# EAGLE design lantern (EAGLE 6.5.0)
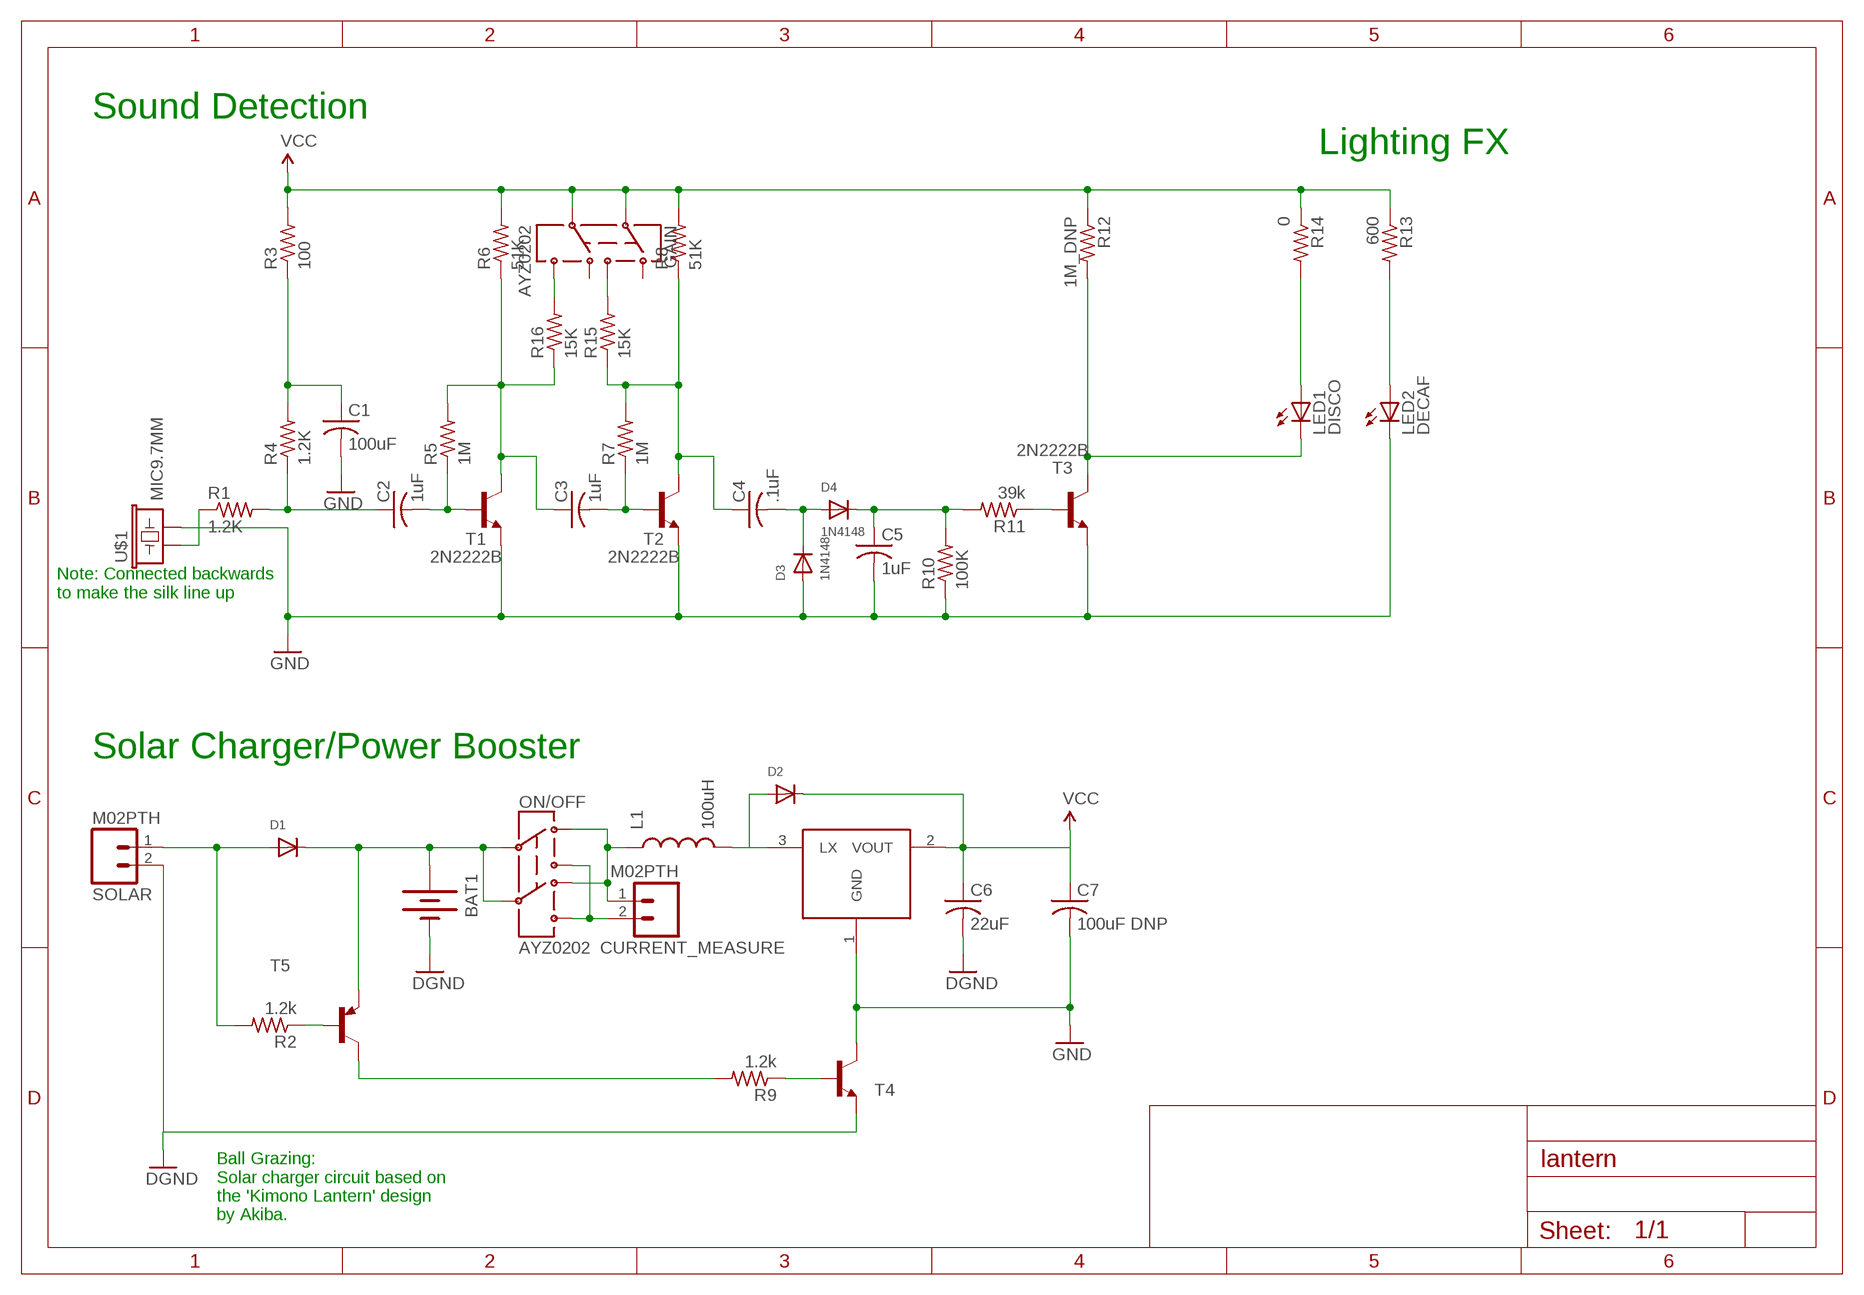
[diagram p0: schematic, sheet 1]

## Parts
BAT1  BATTERYAAA  [BATTERY-AAA]
C1  100uF  C-USC1210  [C1210]
C2  1uF  C-USC0603  [C0603]
C3  1uF  C-USC0603  [C0603]
C4  .1uF  C-USC0603  [C0603]
C5  1uF  C-USC0603  [C0603]
C6  22uF  C-USC0603  [C0603]
C7  100uF DNP  C-USC1210  [C1210]
CURRENT_MEASURE  M02PTH  [1X02]
D1  DIODESOT23_REFLOW  [SOT23-R]
D2  DIODESOT23_REFLOW  [SOT23-R]
D3  1N4148  DIODESOT23_REFLOW  [SOT23-R]
D4  1N4148  DIODESOT23_REFLOW  [SOT23-R]
GAIN  AYZ0202  [AYZ0202]
L1  100uH  INDUCTOR0805  [0805]
LED1  DISCO  LED5MM  [LED5MM]
LED2  DECAF  LED5MM  [LED5MM]
ON/OFF  AYZ0202  [AYZ0202]
R1  1.2K  R-US_R0603  [R0603]
R2  1.2k  R-US_R0603  [R0603]
R3  100  R-US_R0603  [R0603]
R4  1.2K  R-US_R0603  [R0603]
R5  1M  R-US_R0603  [R0603]
R6  51K  R-US_R0603  [R0603]
R7  1M  R-US_R0603  [R0603]
R8  51K  R-US_R0603  [R0603]
R9  1.2k  R-US_R0603  [R0603]
R10  100K  R-US_R0603  [R0603]
R11  39k  R-US_R0603  [R0603]
R12  1M_DNP  R-US_R0603  [R0603]
R13  600  R-US_R0603  [R0603]
R14  0  R-US_R0603  [R0603]
R15  15K  R-US_R0603  [R0603]
R16  15K  R-US_R0603  [R0603]
SOLAR  M02PTH  [1X02]
T1  2N2222B  [SOT23]
T2  2N2222B  [SOT23]
T3  2N2222B  [SOT23]
T4  2N2222B  [SOT23]
T5  2N2907B  [SOT23]
U2  HT7733A  [SOT89]
U$1  MIC9.7MM  [MIC-9.7MM]

## Nets
DGND: BAT1.GND@1(-) C6.2 SOLAR.2 T4.2(E)
GND: C1.2 C5.2 C7.2 D3.1(A) LED2.K(C) R10.1 T1.2(E) T2.2(E) T3.2(E) T4.3(C) U2.1(GND) U$1.2
N$1: C2.1 R1.2 R4.1
N$2: C1.1 R3.1 R4.2
N$3: C2.2 R5.1 T1.1(B)
N$4: C3.1 R5.2 R6.1 R16.1 T1.3(C)
N$5: C4.1 R7.2 R8.1 R15.1 T2.3(C)
N$6: C3.2 R7.1 T2.1(B)
N$7: R1.1 U$1.1
N$8: LED1.K(C) R12.2 T3.3(C)
N$9: R11.1 T3.1(B)
N$10: C4.2 D3.3(C) D4.1(A)
N$11: D1.1(A) R2.2 SOLAR.1
N$12: C5.1 D4.3(C) R10.2 R11.2
N$13: R9.2 T5.3(C)
N$14: R9.1 T4.1(B)
N$15: BAT1.PWR@1(+) D1.3(C) ON/OFF.2 ON/OFF.5 T5.2(E)
N$16: R2.1 T5.1(B)
N$17: CURRENT_MEASURE.1 L1.1 ON/OFF.3 ON/OFF.6
N$18: D2.1(A) L1.2 U2.3(LX)
N$19: LED2.A R13.2
N$20: LED1.A R14.2
N$21: CURRENT_MEASURE.2 ON/OFF.1 ON/OFF.4
N$22: GAIN.4 R16.2
N$23: GAIN.1 R15.2
VCC: C6.1 C7.1 D2.3(C) GAIN.2 GAIN.5 R3.2 R6.2 R8.2 R12.1 R13.1 R14.1 U2.2(VOUT)
Unconnected: GAIN.3 GAIN.6

## Notes on the sheet
- Sound Detection
- Lighting FX
- Note: Connected backwards
  to make the silk line up
- Solar Charger/Power Booster
- Ball Grazing:
  Solar charger circuit based on
  the 'Kimono Lantern' design
  by Akiba.

## Library data of the parts
BAT1 = SparkFun-Electromechanical:BATTERY: Battery Holders Various common sizes : AA, AAA, 20mm coin cell and 12mm coin cell. 20MM_4LEGS, BATT-10373
C1-C7 = adafruit:C-US: CAPACITOR, American symbol
CURRENT_MEASURE SOLAR = SparkFun-Connectors:M02: Standard 2-pin 0.1" header. Use with - straight break away headers ( PRT-00116) - right angle break away headers (PRT-00553) - swiss pins (PRT-00743) - machine pins (PRT-00117) - female headers (PRT-00115) Molex polarized connector foot print use with: PRT-08233 with associated crimp pins and housings. 2.54_SCREWTERM for use with PRT-10571. 3.5mm Screw Terminal footprints for PRT-08084 5mm Screw Terminal footprints for use with PRT-08433
D1-D4 = adafruit:DIODE: Diode SMADIODE - SMA Surface Mount Package 20V 1A Schottky Diode Digikey: 641-1014-6-ND DO-1N4148 - Through Hole Small Current Diode SOD-123 20V 1 A (.5mV Vf) Schottky Diode - Digikey: MBRX120TPMSCT-ND SOD-323 10V 570mA (.38mV Vf, 3ns) Schottky Diode - Digikey: ZLLS410CT-ND SOD-523 30V 30mA Schottky Diode (RB751S-40TE61) - Digikey: RB751S-40TE61CT-ND SOT23-R/W - SOT23 Package (R = Solder Paste/Reflow Ovens, W = Hand-Soldering) BAT54Film 40V 300mA - Digikey: 497-7162-1-ND
GAIN ON/OFF = SparkFun-Electromechanical:AYZ0202: SPDT Slide Switch Simple SMD single-pull double-throw slide switch. Good for less than 350mA power switch, switching UARTs between devices, etc. Spark Fun Electronics SKU : COM-00597
L1 = SparkFun-Passives:INDUCTOR: Inductors Basic Inductor/Choke - 0603 and 1206. Footprints are not proven and vary greatly between part numbers. SRN6045- 33uH, 20% 1.4A
LED1 LED2 = adafruit:LED: LED OSRAM: - CHIPLED LG R971, LG N971, LY N971, LG Q971, LY Q971, LO R971, LY R971 LH N974, LH R974 LS Q976, LO Q976, LY Q976 LO Q996 - Hyper CHIPLED LW Q18S LB Q993, LB Q99A, LB R99A - SideLED LS A670, LO A670, LY A670, LG A670, LP A670 LB A673, LV A673, LT A673, LW A673 LH A674 LY A675 LS A676, LA A676, LO A676, LY A676, LW A676 LS A679, LY A679, LG A679 - Hyper Micro SIDELED® LS Y876, LA Y876, LO Y876, LY Y876 LT Y87S - SmartLED LW L88C, LW L88S LB L89C, LB L89S, LG L890 LS L89K, LO L89K, LY L89K LS L896, LA L896, LO L896, LY L896 - TOPLED LS T670, LO T670, LY T670, LG T670, LP T670 LSG T670, LSP T670, LSY T670, LOP T670, LYG T670 LG T671, LOG T671, LSG T671 LB T673, LV T673, LT T673, LW T673 LH T674 LS T676, LA T676, LO T676, LY T676, LB T676, LH T676, LSB T676, LW T676 LB T67C, LV T67C, LT T67C, LS T67K, LO T67K, LY T67K, LW E67C LS E67B, LA E67B, LO E67B, LY E67B, LB E67C, LV E67C, LT E67C LW T67C LS T679, LY T679, LG T679 LS T770, LO T770, LY T770, LG T770, LP T770 LB T773, LV T773, LT T773, LW T773 LH T774 LS E675, LA E675, LY E675, LS T675 LS T776, LA T776, LO T776, LY T776, LB T776 LHGB T686 LT T68C, LB T68C - Hyper Mini TOPLED® LB M676 - Mini TOPLED Santana® LG M470 LS M47K, LO M47K, LY M47K Source: http://www.osram.convergy.de/
R1-R16 = adafruit:R-US_: RESISTOR, American symbol
T1-T4 = blinkinlabs:2N2222: NPN TRANSISTOR Big oval pads
T5 = blinkinlabs:2N2907*: PNP Transistor Big Oval pads
U2 = blinkinlabs:HT7733A
U$1 = SparkFun-Sensors:MIC: Omni-directional electret microphone. 9.7mm standard diameter.

## Board
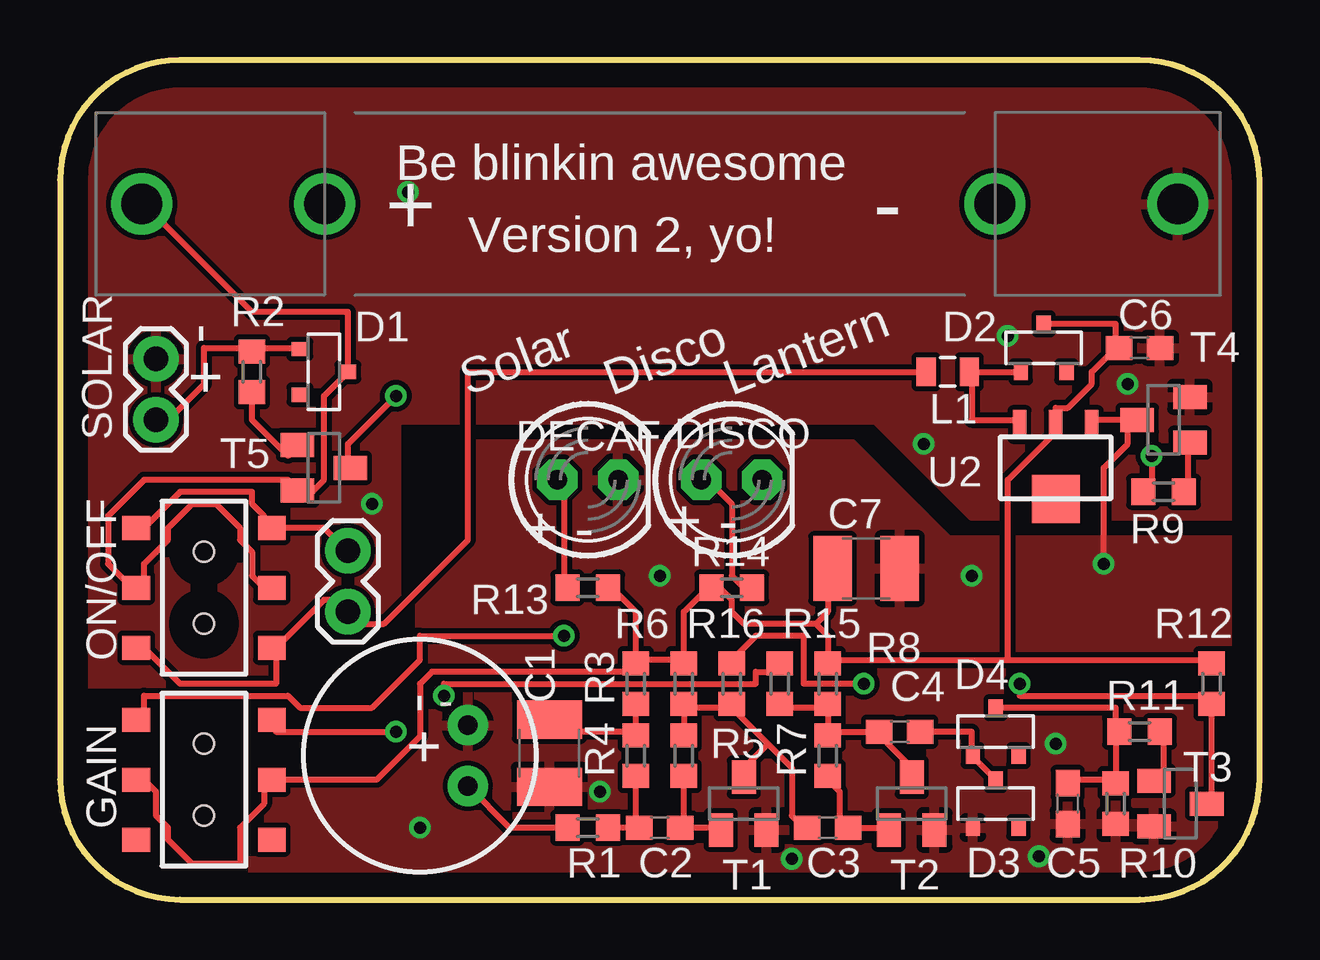
[diagram p1: board, top side]
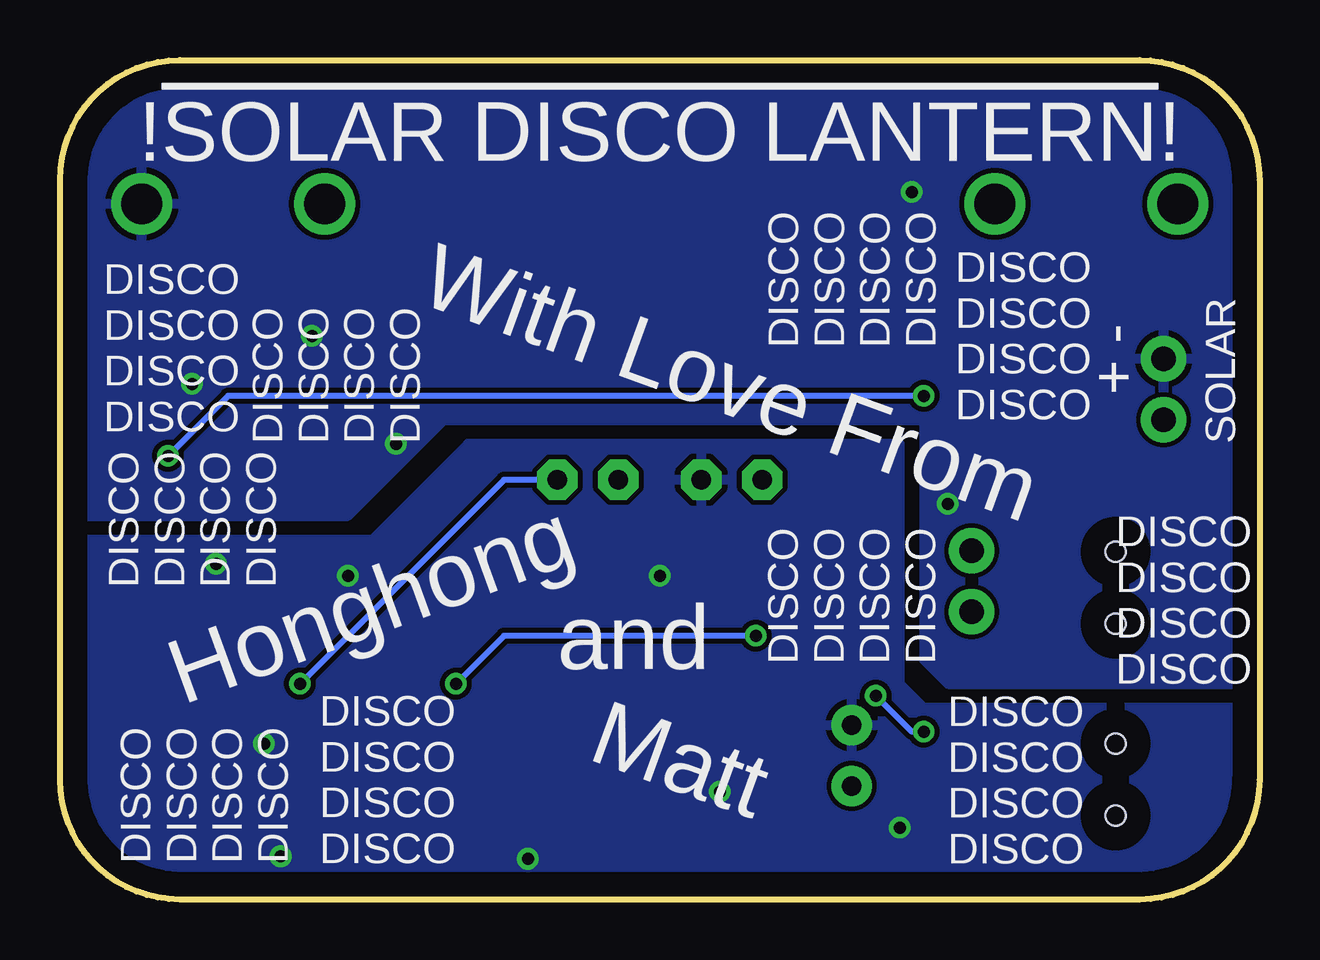
[diagram p2: board, bottom side, seen from below]

Size 50 x 35 mm. Coordinates in mm from the lower left corner, seen from the top.
Outline: 0,30 0,5 arc90 5,0 45,0 arc90 50,5 50,30 arc90 45,35 5,35 arc90 0,30
Copper layers (1*16): Top 0.035mm / dielectric 1.5mm / Bottom 0.035mm
Design rules "default *": minimum track width 10mil, minimum drill 0.3mm, track to track 8mil, track to pad 8mil, pad to pad 8mil, via to via 8mil, smd to smd 8mil, copper to edge 40mil, drill to drill 8mil, minimum pad ring 10mil, minimum via ring 8mil, stop-mask expansion 4mil, vias tented up to drill 0.5mm, thermal gap 10mil

### Footprints (pad centres in the part's own frame; a part is rotated, then mirrored left to right if it is on the bottom)
BATTERY-AAA = drill 1.702: GND@1 21.59,0; GND@2 13.97,0; PWR@1 -21.59,0; PWR@2 -13.97,0
C1210 = smd 1.6 x 2.7: 1 -1.4,0; 2 1.4,0
C0603 = smd 1.1 x 1: 1 -0.85,0; 2 0.85,0
1X02 = drill 1.016 pad 1.88: 1 0,0; 2 2.54,0
SOT23-R = smd 0.6 x 0.7: 1 -0.95,-1; 2 0.95,-1; 3 0,1
AYZ0202 = smd 1 x 1.15: 1 -2.5,2.825; 2 0,2.825; 3 2.5,2.825; 4 -2.5,-2.825; 5 0,-2.825; 6 2.5,-2.825 | hole 0.85: 1.5,0; -1.5,0
0805 = smd 0.8 x 1.2: 1 -0.9,0; 2 0.9,0
LED5MM = drill 0.813 pad 1.676 octagon: A -1.27,0; K 1.27,0
R0603 = smd 1 x 1.1: 1 -0.85,0; 2 0.85,0
SOT23 = smd 1 x 1.4: 1 -0.95,-1.1; 2 0.95,-1.1; 3 0,1.1
SOT89 = smd 0.58 x 1.2: 1 -1.5,-1.8; 2 0,-1.8; 3 1.5,-1.8 | smd 2 x 2: 4 0,1.3
MIC-9.7MM = drill 0.8 pad 1.676: 1 -2,1.27; 2 -2,-1.27

### Placement (x,y rotation side)
BAT1  25,29 0 top
C1  20.4,6.1 270 top
C2  25,3 0 top
C3  32,3 0 top
C4  35,7 0 top
C5  42,4 270 top
C6  45,23 0 top
C7  33.6,13.8 0 top
CURRENT_MEASURE  12,12 90 top
D1  11,22 270 top
D2  41,23 0 top
D3  39,4 0 top
D4  39,7 0 top
GAIN  6,5 270 top
L1  37,22 0 top
LED1  28,17.5 0 top
LED2  22,17.5 0 top
ON/OFF  6,13 270 top
R1  22,3 0 top
R2  8,22 90 top
R3  24,9 90 top
R4  24,6 90 top
R5  26,6 90 top
R6  26,9 90 top
R7  32,6 90 top
R8  32,9 90 top
R9  46,17 180 top
R10  44,4 90 top
R11  45,7 180 top
R12  48,9 270 top
R13  22,13 180 top
R14  28,13 0 top
R15  30,9 90 top
R16  28,9 90 top
SOLAR  4,20 90 top
T1  28.5,4 0 top
T2  35.5,4 0 top
T3  46.7,4 270 top
T4  46,20 90 top
T5  11,18 270 top
U2  41.5,18 180 top
U$1  15,6 180 top

### Tracks (layer width: path | path; a pad name or v marks a point on that pad's centre or on a via)
DGND  (via drill 0.5)
  other vias: 44.5,21.5 14.5,29.5 36,19 13,16.5 39.5,23.5
  pour Bottom: 0,35 50,35 50,16 38,16 34,20 14,20 14,10 13,9 0,9
  pour Top: 0,35 50,35 50,16 38,16 34,20 14,20 14,10 13,9 0,9
GND  (via drill 0.5)
  Top 0.254: 44.5,20 43,20 U2.1 | 44.5,20 44.5,19 43.5,18 v43.5,14 | 44.5,20 T4.3
  other vias: 30.5,1.7 15,3 22.5,4.5 41.5,6.5 38,13.5 25,13.5 40.8,1.8
  pour Bottom: 0,8 14,8 15,9 15,19 33,19 37,15 50,15 50,0 0,0
  pour Top: 0,8 14,8 15,9 15,19 33,19 37,15 50,15 50,0 0,0
N$1
  Top 0.254: 24,3 R1.2 | 24,3 R4.1 | 24,3 C2.1
N$2
  Top 0.254: 24,7 21,7 C1.1 | 24,7 R3.1 | 24,7 R4.2
N$3
  Top 0.254: 26,3 27.5,3 T1.1 | 26,3 R5.1 | 26,3 C2.2
N$4
  Top 0.254: 26,8 R5.2 | 28,8 29.5,6.5 | 29.5,6.5 30.5,5.5 30.5,3.5 31,3 C3.1 | 29.5,6.5 28.5,5.5 T1.3 | 28,8 26,8 | 26,8 R6.1 | 28,8 R16.1
N$5
  Top 0.254: 32,8 32,7 | 32,8 30,8 R15.1 | 32,8 R8.1 | 32,7 C4.1 34.5,7 34.5,6.5 35.5,5.5 T2.3 | 32,7 R7.2
N$6
  Top 0.254: R7.1 32,5 32.5,4.5 32.5,3 C3.2 34.5,3 T2.1
N$7
  Top 0.254: R1.1 18.73,3 U$1.1
N$8  (via drill 0.5)
  Top 0.254: T3.3 48,4 R12.2 48,8.5 40,8.5 v40,9
  Bottom 0.254: v40,9 31.5,17.5 LED1.K
N$9
  Top 0.254: R11.1 46,7 46,5 T3.1
N$10
  Top 0.254: 38,6 D3.3 | C4.2 38,7 38,6 | 38,6 D4.1
N$11
  Top 0.254: 8,23 10,23 D1.1 | 8,23 6,23 6,21.5 4.5,20 SOLAR.1 | 8,23 R2.2
N$12
  Top 0.254: 44,5 42,5 C5.1 | D4.3 44,8 44,7 | 44,7 44,5 | 44,5 R10.2 | 44,7 R11.2
N$13  (via drill 0.5)
  Top 0.254: v45.5,18.5 45.5,17 R9.2 | v14,21 12,19 12,18 T5.3
  Bottom 0.254: v45.5,18.5 43,21 v14,21
N$14
  Top 0.254: R9.1 47,17 47,19 T4.1
N$15
  Top 0.254: ON/OFF.2 8.5,13 8,13.5 8,14.5 7.5,15 7.5,15.5 6.5,16.5 5.5,16.5 4.5,15.5 4.5,15 3.5,14 3.5,13 ON/OFF.5 3,13 2,14 2,16 3.5,17.5 9.5,17.5 T5.2 10,17 10.5,17 11,17.5 11,21 D1.3 12,24.5 8,24.5 3.5,29 BAT1.PWR@1
N$16
  Top 0.254: R2.1 8,20 9.5,18.5 T5.1
N$17
  Top 0.254: 9,10.5 9,9 5,9 3.5,10.5 ON/OFF.6 | L1.1 17,22 17,15 13.5,11.5 12,11.5 CURRENT_MEASURE.1 12,12.5 11,12.5 9,10.5 | 9,10.5 ON/OFF.3
N$18
  Top 0.254: 38,22 D2.1 | 38,22 38,20 40,20 U2.3 | 38,22 L1.2
N$19
  Top 0.254: R13.2 21,13 21,17.5 LED2.A
N$20
  Top 0.254: R14.2 28.5,13 28,13.5 28,16.5 27,17.5 LED1.A
N$21
  Top 0.254: ON/OFF.4 3.5,15.5 5,17 8,17 8,16.5 8.5,16 8.5,15.5 ON/OFF.1 11,15.5 12,14.5 CURRENT_MEASURE.2
N$22  (via drill 0.5)
  Top 0.254: v33.5,9 31,9 31,11 29,11 28,10 R16.2 | v21,11 15,11 15,10 13,8 10,8 9.5,8.5 3.5,8.5 3.5,7.5 GAIN.4
  Bottom 0.254: v33.5,9 31.5,11 v21,11
N$23  (via drill 0.5)
  Top 0.254: v16,8.5 16,9 29,9 29,9.5 30,9.5 R15.2 | v14,7 9,7 9,7.5 GAIN.1
  Bottom 0.254: v16,8.5 14.5,7 v14,7
VCC
  Top 0.254: GAIN.5 3.5,5 4,4.5 4,3.5 4.5,3 4.5,2.5 5.5,1.5 7.5,1.5 7.5,3 8.5,4 8.5,5 GAIN.2 13.2,5 15,6.8 15,9 15.5,9.5 24,9.5 R3.2 24,10 | 26,10 24,10 | 24,10 24,12 23,13 R13.1 | 26,10 26,12 27,13 R14.1 27.5,13 28,12.5 28,12 28.5,11.5 31.5,11.5 | 26,10 R6.2 | D2.3 44,24 44,23 | 31.5,11.5 32,12 32,13 C7.1 | 31.5,11.5 32,11 32,10 | 32,10 39.5,10 | 39.5,10 48,10 R12.1 | 32,10 R8.2 | 39.5,10 39.5,17.5 41.5,19.5 U2.2 41.5,20.5 42,20.5 43,21.5 43,22 44,23 | 44,23 C6.1

### Text on the board
tNames: Be blinkin awesome | Version 2, yo! | + - | Solar | Disco | Lantern | - + | - + | + -
bNames: !!SOLAR DISCO LANTERN!! | DISCO / DISCO / DISCO / DISCO | DISCO / DISCO / DISCO / DISCO | + - | DISCO / DISCO / DISCO / DISCO | With Love From | SOLAR | DISCO / DISCO / DISCO / DISCO | DISCO / DISCO / DISCO / DISCO | DISCO / DISCO / DISCO / DISCO | Honghong | and | DISCO / DISCO / DISCO / DISCO | DISCO / DISCO / DISCO / DISCO | Matt | DISCO / DISCO / DISCO / DISCO | DISCO / DISCO / DISCO / DISCO
bDocu: Solar Disco Lantern | With love from | Honghong | and | Matt